# Altium schematic sheet Quadcopter_controller.SchDoc
size A4
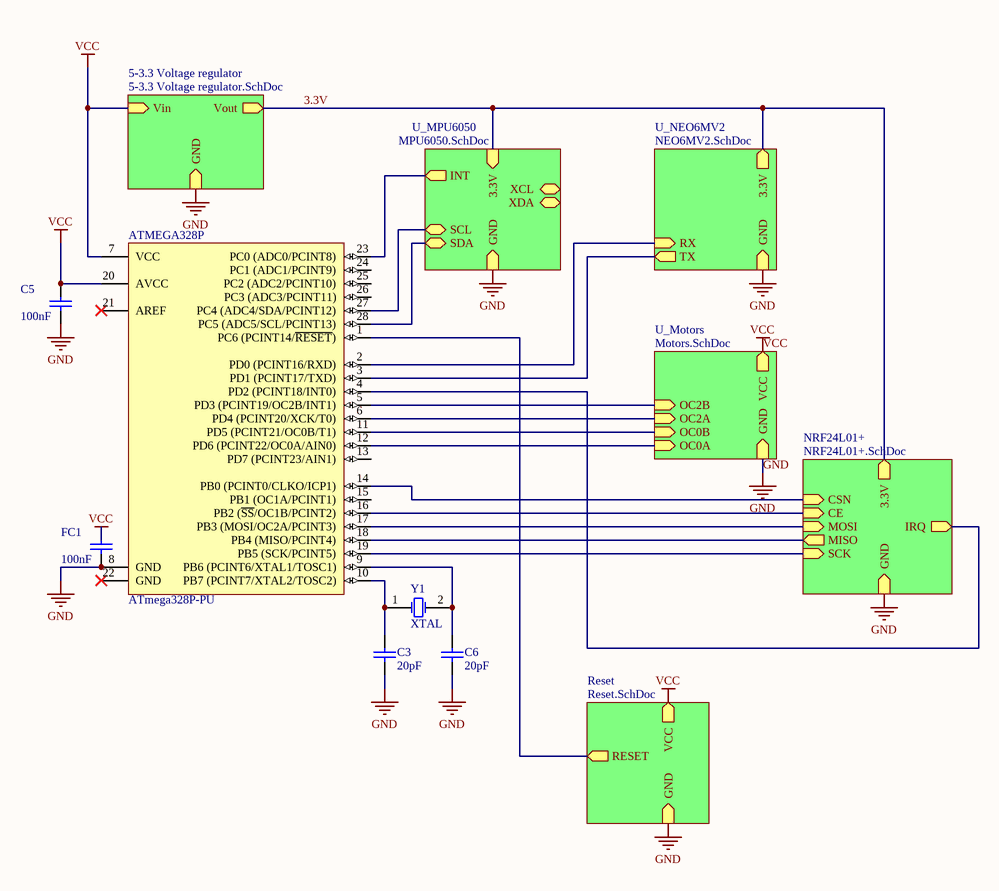
[diagram p0: Quadcopter_controller.SchDoc]

## Parts
ATMEGA328P  ATmega328P-PU  [28P3]
C3  20pF  [RAD-0.3]
C5  100nF  [RAD-0.3]
C6  20pF  [RAD-0.3]
FC1  100nF  [RAD-0.3]
Y1  XTAL  [R38]

## Sub-sheets
5-3.3 Voltage regulator = 5-3.3 Voltage regulator.SchDoc: Vin, Vout, GND
NRF24L01+ = NRF24L01+.SchDoc: MOSI (in), SCK (in), 3.3V, CSN (in), CE (in), IRQ (out), MISO (out), GND
Reset = Reset.SchDoc: RESET (out), VCC, GND
U_Motors = Motors.SchDoc: OC0A (in), OC0B (in), OC2A (in), OC2B (in), GND, VCC
U_MPU6050 = MPU6050.SchDoc: 3.3V (in), GND (in), SCL (bidir), SDA (bidir), XDA (bidir), XCL (bidir), INT (out)
U_NEO6MV2 = NEO6MV2.SchDoc: GND, 3.3V, RX (in), TX (out)

## Nets
GND: ATMEGA328P.8(GND) C3.1 C5.1 C6.1 FC1.1 ; sheet 5-3.3 Voltage regulator/GND, sheet NRF24L01+/GND, sheet U_Motors/GND, sheet U_NEO6MV2/GND, sheet Reset/GND, sheet U_MPU6050/GND
VCC: ATMEGA328P.7(VCC) ATMEGA328P.20(AVCC) C5.2 FC1.2 ; sheet 5-3.3 Voltage regulator/Vin, sheet U_Motors/VCC, sheet Reset/VCC
3.3V: sheet 5-3.3 Voltage regulator/Vout, sheet NRF24L01+/3.3V, sheet U_NEO6MV2/3.3V, sheet U_MPU6050/3.3V
NetATMEGA328P_1: ATMEGA328P.1(PC6_(PCINT14/~{RESET})) ; sheet Reset/RESET
NetATMEGA328P_2: ATMEGA328P.2(PD0_(PCINT16/RXD)) ; sheet U_NEO6MV2/RX
NetATMEGA328P_3: ATMEGA328P.3(PD1_(PCINT17/TXD)) ; sheet U_NEO6MV2/TX
NetATMEGA328P_4: ATMEGA328P.4(PD2_(PCINT18/INT0)) ; sheet NRF24L01+/IRQ
NetATMEGA328P_5: ATMEGA328P.5(PD3_(PCINT19/OC2B/INT1)) ; sheet U_Motors/OC2B
NetATMEGA328P_6: ATMEGA328P.6(PD4_(PCINT20/XCK/T0)) ; sheet U_Motors/OC2A
NetATMEGA328P_9: ATMEGA328P.9(PB6_(PCINT6/XTAL1/TOSC1)) C6.2 Y1.2(OSC2)
NetATMEGA328P_10: ATMEGA328P.10(PB7_(PCINT7/XTAL2/TOSC2)) C3.2 Y1.1(OSC1)
NetATMEGA328P_11: ATMEGA328P.11(PD5_(PCINT21/OC0B/T1)) ; sheet U_Motors/OC0B
NetATMEGA328P_12: ATMEGA328P.12(PD6_(PCINT22/OC0A/AIN0)) ; sheet U_Motors/OC0A
NetATMEGA328P_14: ATMEGA328P.14(PB0_(PCINT0/CLKO/ICP1)) ; sheet NRF24L01+/CSN
NetATMEGA328P_16: ATMEGA328P.16(PB2_(~{SS}/OC1B/PCINT2)) ; sheet NRF24L01+/CE
NetATMEGA328P_17: ATMEGA328P.17(PB3_(MOSI/OC2A/PCINT3)) ; sheet NRF24L01+/MOSI
NetATMEGA328P_18: ATMEGA328P.18(PB4_(MISO/PCINT4)) ; sheet NRF24L01+/MISO
NetATMEGA328P_19: ATMEGA328P.19(PB5_(SCK/PCINT5)) ; sheet NRF24L01+/SCK
NetATMEGA328P_23: ATMEGA328P.23(PC0_(ADC0/PCINT8)) ; sheet U_MPU6050/INT
NetATMEGA328P_27: ATMEGA328P.27(PC4_(ADC4/SDA/PCINT12)) ; sheet U_MPU6050/SCL
NetATMEGA328P_28: ATMEGA328P.28(PC5_(ADC5/SCL/PCINT13)) ; sheet U_MPU6050/SDA

Not connected (* = marked no-connect by the designer): ATMEGA328P 13(PD7_(PCINT23/AIN1)) 15(PB1_(OC1A/PCINT1)) 21(AREF)* 22(GND)* 24(PC1_(ADC1/PCINT9)) 25(PC2_(ADC2/PCINT10)) 26(PC3_(ADC3/PCINT11))

## Library data of the parts
ATMEGA328P = ATmega328P-PU: 8-bit AVR Microcontroller, 32KB Flash, 1KB EEPROM, 2KB SRAM, 28-pin PDIP, Industrial Grade (-40°C to 85°C); DatasheetVersion: revD, May-2011; PackageVersion: revB, Sep-2001; PackageReference: 28P3; PackageDescription: 28-lead (0.300"/7.62mm Wide) Plastic Dual Inline Package (PDIP); ComponentLink1Description: Manufacturer URL; ComponentLink1URL: http://www.atmel.com/; ComponentLink2Description: ATmega48A/48PA/88A/88PA/168A/168PA/328/328P Datasheet; ComponentLink2URL: http://www.atmel.com/dyn/resources/prod_documents/8271.pdf; ComponentLink3Description: ATmega48A/48PA/88A/88PA/168A/168PA/328/328P Summary; ComponentLink3URL: http://www.atmel.com/dyn/resources/prod_documents/8271S.pdf
C3 C5 C6 FC1 = Cap: Capacitor; Published: 8-Jun-2000; LatestRevisionDate: 17-Jul-2002; LatestRevisionNote: Re-released for DXP Platform.; PackageReference: RAD-0.3; Publisher: Altium Limited; PackageDescription: Radial Cap, Thru-Hole; 2 Leads; 0.3 in Pin Spacing
  C3 C6: Value: 20pF
  C5 FC1: Value: 100nF
Y1 = XTAL: Crystal Oscillator; Published: 8-Jun-2000; LatestRevisionDate: 17-Jul-2002; LatestRevisionNote: Re-released for DXP Platform.; PackageReference: R38; Publisher: Altium Limited; PackageDescription: Crystal, Thru-Hole; 2 Leads; Body 3.1 x 8.2 mm (Dia.xH)